# EAGLE design USBdimmer-control (EAGLE 6.5.0)
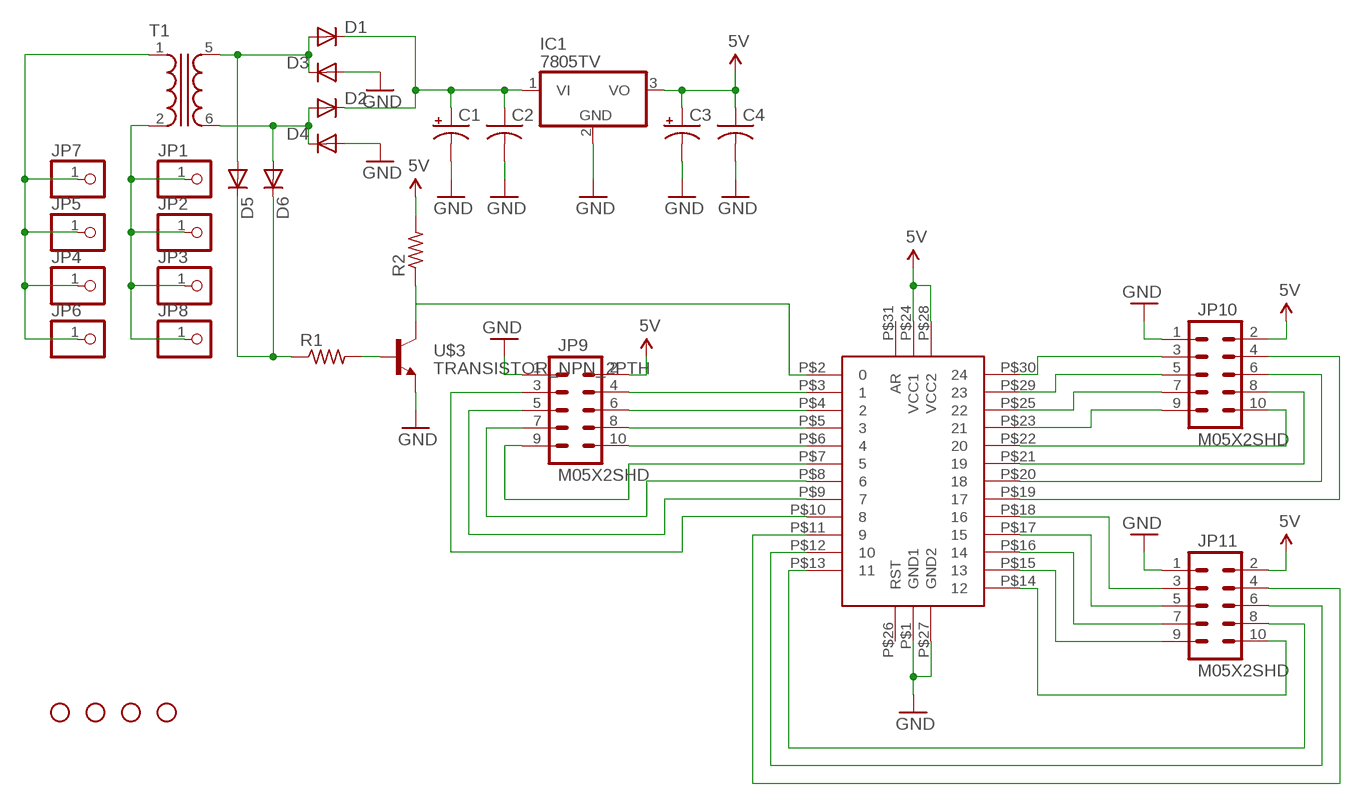
[diagram p0: schematic, sheet 1]

## Parts
C1  CPOL-USE3.5-10  [E3,5-10]
C2  C-US025-030X050  [C025-030X050]
C3  CPOL-USE3.5-10  [E3,5-10]
C4  C-US025-030X050  [C025-030X050]
D1  DIODEPTH  [DIODE-1N4001]
D2  DIODEPTH  [DIODE-1N4001]
D3  DIODEPTH  [DIODE-1N4001]
D4  DIODEPTH  [DIODE-1N4001]
D5  DIODE1N4148  [DIODE-1N4148]
D6  DIODE1N4148  [DIODE-1N4148]
IC1  7805TV  [TO220V]
JP1  PINHD-1X1  [1X01]
JP2  PINHD-1X1  [1X01]
JP3  PINHD-1X1  [1X01]
JP4  PINHD-1X1  [1X01]
JP5  PINHD-1X1  [1X01]
JP6  PINHD-1X1  [1X01]
JP7  PINHD-1X1  [1X01]
JP8  PINHD-1X1  [1X01]
JP9  M05X2SHD  [2X5-SHROUDED]
JP10  M05X2SHD  [2X5-SHROUDED]
JP11  M05X2SHD  [2X5-SHROUDED]
R1  FLIPFLOP-RES  [0805-THM]
R2  FLIPFLOP-RES  [0805-THM]
STANDOFF1  STAND-OFF  [STAND-OFF]
STANDOFF2  STAND-OFF  [STAND-OFF]
STANDOFF3  STAND-OFF  [STAND-OFF]
STANDOFF4  STAND-OFF  [STAND-OFF]
T1  XFORMER  [T70-E]
U$1  TEENSY2  [TEENSY2]
U$3  TRANSISTOR_NPN_2PTH  [TO-92]

## Nets
5V: C3.+ C4.1 IC1.3(VO) JP9.2 JP10.2 JP11.2 R2.2 U$1.P$24(VCC1) U$1.P$28(VCC2)
GND: C1.- C2.2 C3.- C4.2 D3.A D4.A IC1.2(GND) JP9.1 JP10.1 JP11.1 U$1.P$1(GND1) U$1.P$27(GND2) U$3.3(E)
N$1: D2.A D4.C D6.A T1.6(S2)
N$2: D1.A D3.C D5.A T1.5(S1)
N$3: C1.+ C2.1 D1.C D2.C IC1.1(VI)
N$4: JP10.8 U$1.P$21
N$5: JP10.6 U$1.P$20
N$6: R1.2 U$3.2(B)
N$7: D5.C D6.C R1.1
N$8: R2.1 U$1.P$2 U$3.1(C)
N$9: JP10.4 U$1.P$19
N$10: JP11.3 U$1.P$18
N$11: JP4.1 JP5.1 JP6.1 JP7.1 T1.1
N$12: JP9.4 U$1.P$3
N$13: JP9.6 U$1.P$4
N$14: JP9.8 U$1.P$5
N$15: JP9.10 U$1.P$6
N$16: JP9.9 U$1.P$7
N$17: JP9.7 U$1.P$8
N$18: JP1.1 JP2.1 JP3.1 JP8.1 T1.2
N$19: JP11.5 U$1.P$17
N$20: JP11.7 U$1.P$16
N$21: JP9.5 U$1.P$9
N$22: JP9.3 U$1.P$10
N$23: JP10.3 U$1.P$30
N$24: JP11.9 U$1.P$15
N$25: JP11.10 U$1.P$14
N$26: JP10.5 U$1.P$29
N$27: JP10.7 U$1.P$25
N$28: JP10.9 U$1.P$23
N$29: JP10.10 U$1.P$22
N$30: JP11.8 U$1.P$13
N$31: JP11.6 U$1.P$12
N$32: JP11.4 U$1.P$11
Unconnected: T1.3(P1) T1.4(P2) T1.7(S1) T1.8(S2) U$1.P$26(RST) U$1.P$31(AR)

## Library data of the parts
C1 C3 = adafruit:CPOL-US: POLARIZED CAPACITOR, American symbol
C2 C4 = adafruit:C-US: CAPACITOR, American symbol
D1-D6 = SparkFun-DiscreteSemi:DIODE: Diode These are standard reverse protection diodes and small signal diodes. SMA package can handle up to about 1A. SOD-323 can handle about 200mA. What the SOD-323 package when ordering, there are some mfgs out there that are 5-pin packages.
IC1 = linear:78*: Positive VOLTAGE REGULATOR Source: http://cache.national.com/ds/LM/LM78L05.pdf http://www.fairchildsemi.com/ds/LM/LM7805.pdf
JP1-JP8 = adafruit:PINHD-1X1: Pin header 1x1 for 0.1" spacing With round pins
JP9-JP11 = SparkFun-Connectors:M05X2: Header 5x2 Standard 10-pin dual row 0.1" header. Commonly used with AVR-ISP. Use with Spark Fun Electronics SKU: PRT-00778
R1 R2 = adafruit:FLIPFLOP-RES: Flip Flop resistor An 0805 resistor inside a standard 1/4W 5% resistor. Makes for easy mods
STANDOFF1-STANDOFF4 = SparkFun-Electromechanical:STAND-OFF: #4 Stand Off This is the mechanical footprint for a #4 phillips button head screw. Use the keepout ring to avoid running the screw head into surrounding components. SKU : PRT-00447
T1 = special:XFORMER: TRANSFORMER 2 x primary, 2 x secondary
U$1 = bodger:TEENSY2
U$3 = SparkFun-DiscreteSemi:TRANSISTOR_NPN_2: Alternate TO-92 NPN BJT

## Board
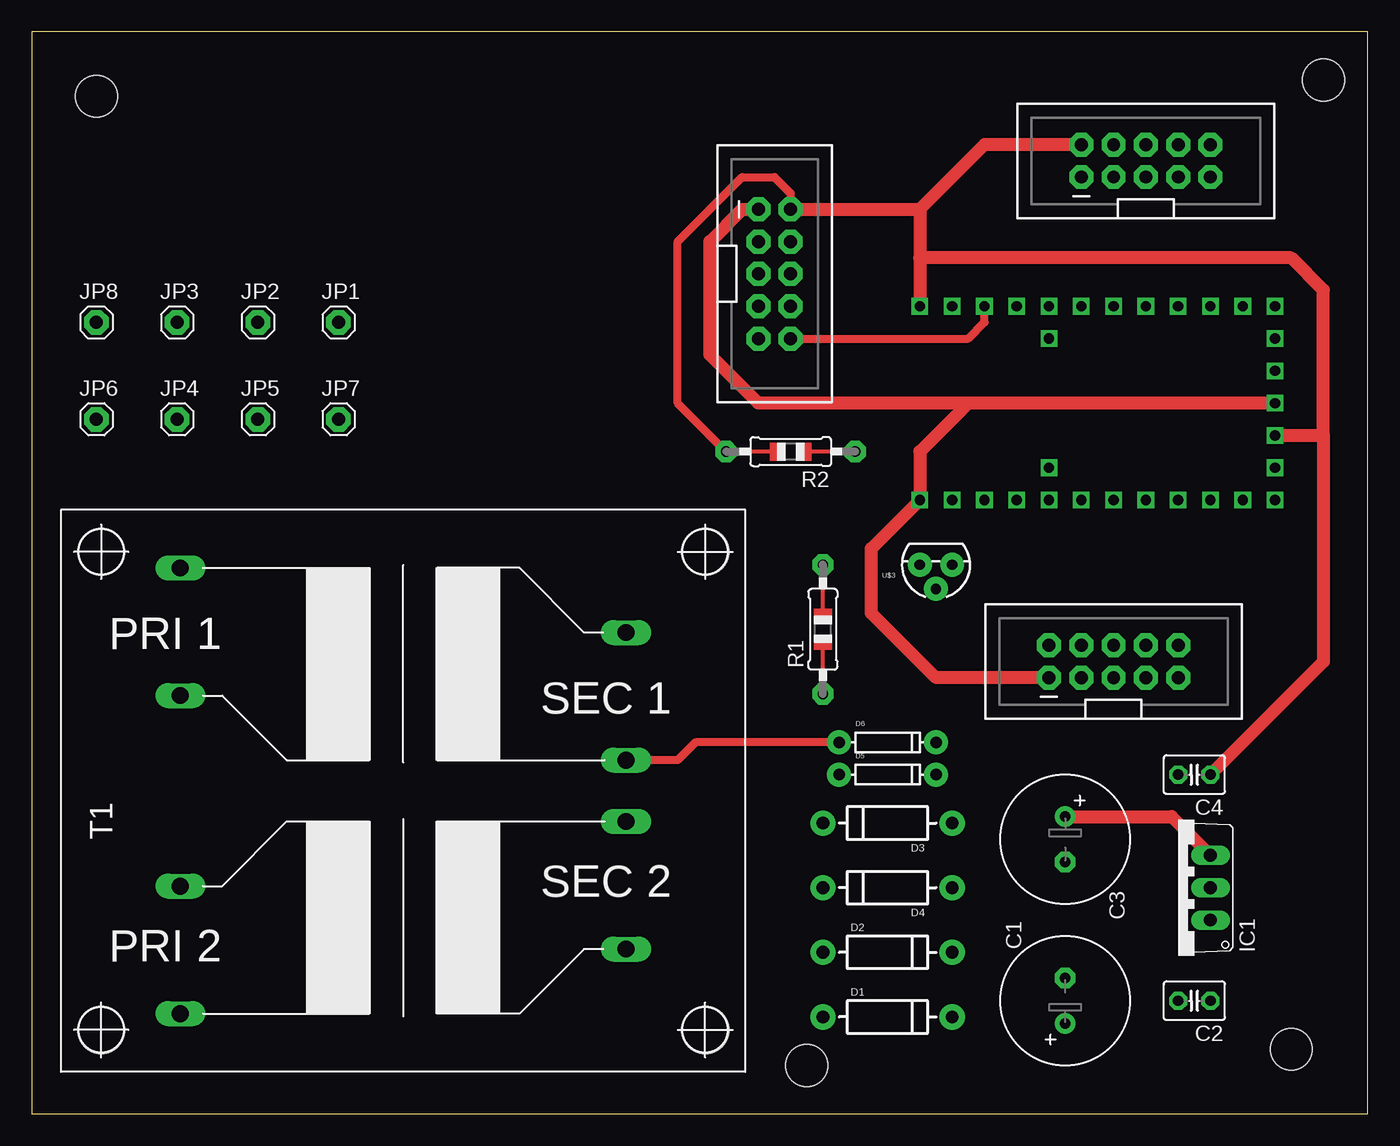
[diagram p1: board, top side]
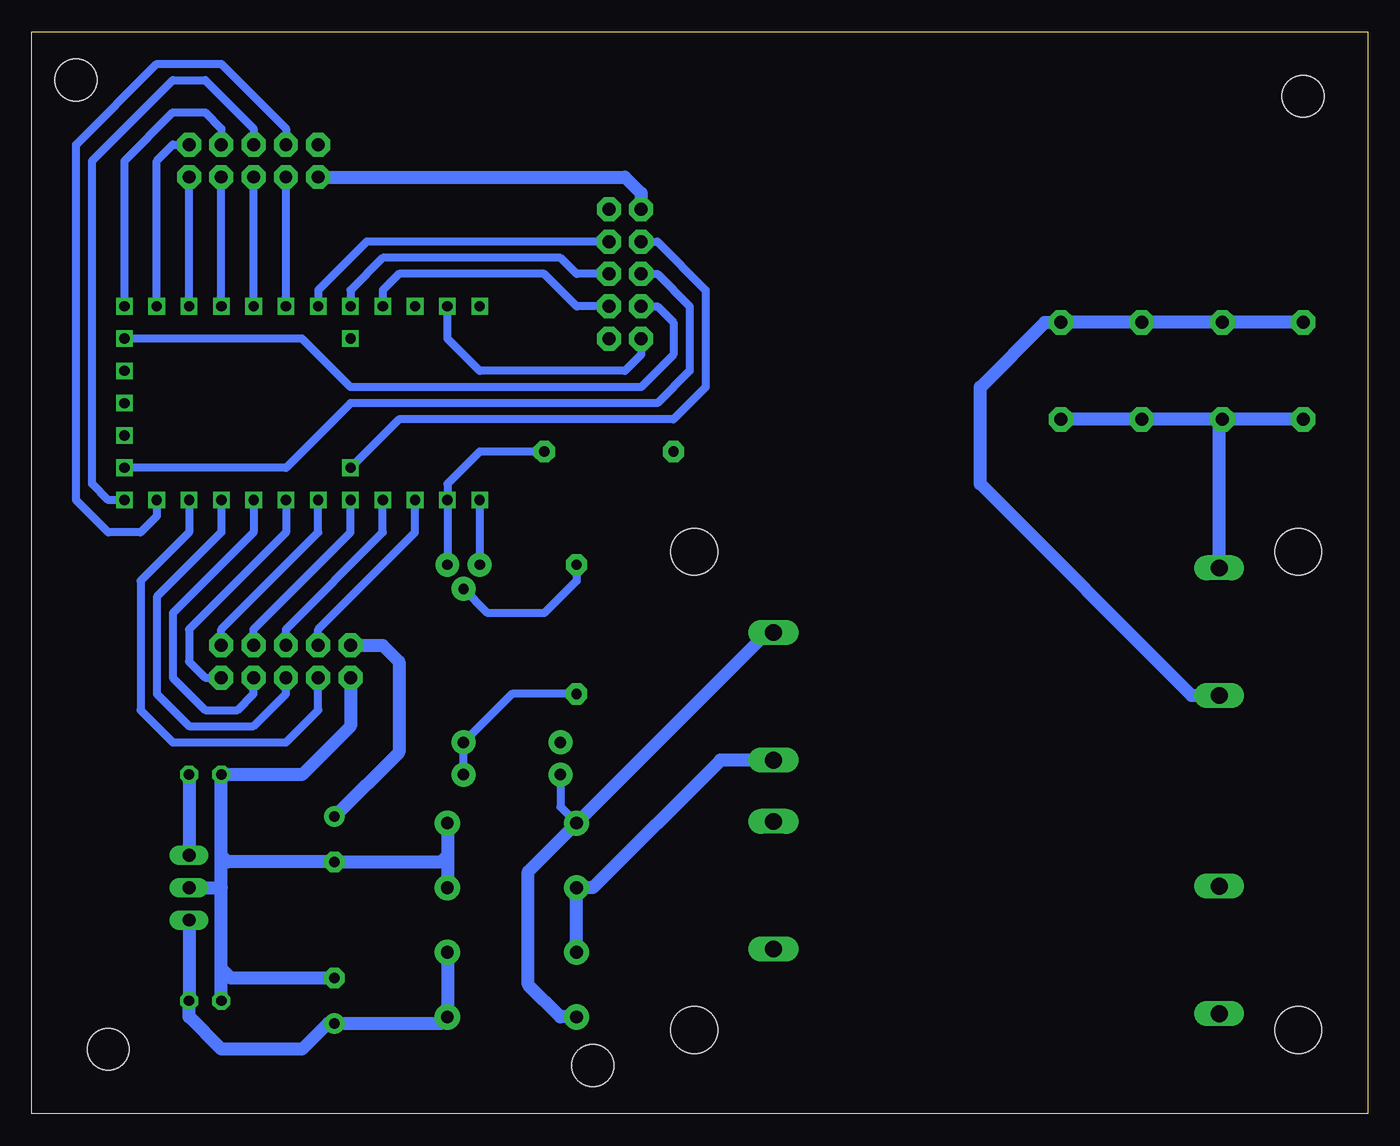
[diagram p2: board, bottom side, seen from below]

Size 105.08 x 85.08 mm. Coordinates in mm from the lower left corner, seen from the top.
Outline: 0,0 105.08,0 105.08,85.08 0,85.08 0,0
Copper layers (1*16): Top 0.035mm / dielectric 1.5mm / Bottom 0.035mm
Design rules "default": minimum track width 10mil, minimum drill 24mil, track to track 8mil, track to pad 8mil, pad to pad 8mil, via to via 8mil, smd to smd 8mil, copper to edge 40mil, drill to drill 8mil, minimum pad ring 10mil, minimum via ring 8mil, stop-mask expansion 4mil, vias tented up to drill 0mil, thermal gap 10mil

### Footprints (pad centres in the part's own frame; a part is rotated, then mirrored left to right if it is on the bottom)
E3,5-10 = drill 0.813 pad 1.6: + -1.778,0 | drill 0.813 pad 1.6 octagon: - 1.778,0
C025-030X050 = drill 0.813 pad 1.422 octagon: 1 -1.27,0; 2 1.27,0
DIODE-1N4001 = drill 1 pad 1.981: A -5.08,0; C 5.08,0
DIODE-1N4148 = drill 0.9 pad 1.88: A -3.81,0; C 3.81,0
TO220V = drill 1.016 long: 1 -2.54,-2.54; 2 0,-2.54; 3 2.54,-2.54
1X01 = drill 1.016 pad 1.93 octagon: 1 0,0
2X5-SHROUDED = drill 1.016 pad 1.88 octagon: 1 -1.27,5.08; 2 1.27,5.08; 3 -1.27,2.54; 4 1.27,2.54; 5 -1.27,0; 6 1.27,0; 7 -1.27,-2.54; 8 1.27,-2.54; 9 -1.27,-5.08; 10 1.27,-5.08
0805-THM = drill 0.813 pad 1.676 octagon: 1 -5.08,0; 2 5.08,0
STAND-OFF = hole 3.302: 0,0
T70-E = drill 1.321 long: 1 -17.526,17.526; 2 -17.526,7.493; 3 -17.526,-7.493; 4 -17.526,-17.526; 5 17.526,12.446; 6 17.526,2.413; 7 17.526,-2.413; 8 17.526,-12.446 | hole 3.708: 23.749,18.796; 23.749,-18.796; -23.749,-18.796; -23.749,18.796
TEENSY2 = drill 0.8 square: P$1 -7.62,15.24; P$2 -7.62,12.7; P$3 -7.62,10.16; P$4 -7.62,7.62; P$5 -7.62,5.08; P$6 -7.62,2.54; P$7 -7.62,0; P$8 -7.62,-2.54; P$9 -7.62,-5.08; P$10 -7.62,-7.62; P$11 -7.62,-10.16; P$12 -7.62,-12.7; P$13 7.62,-12.7; P$14 7.62,-10.16; P$15 7.62,-7.62; P$16 7.62,-5.08; P$17 7.62,-2.54; P$18 7.62,0; P$19 7.62,2.54; P$20 7.62,5.08; P$21 7.62,7.62; P$22 7.62,10.16; P$23 7.62,12.7; P$24 7.62,15.24; P$25 5.08,-12.7; P$26 2.54,-12.7; P$27 0,-12.7; P$28 -2.54,-12.7; P$29 -5.08,-12.7; P$30 -5.08,5.08; P$31 5.08,5.08
TO-92 = drill 0.813 pad 1.88: 1 -1.27,0; 2 0,1.905; 3 1.27,0

### Placement (x,y rotation side)
C1  81.28,8.89 90 top
C2  91.44,8.89 180 top
C3  81.28,21.59 270 top
C4  91.44,26.67 180 top
D1  67.31,7.62 0 top
D2  67.31,12.7 0 top
D3  67.31,22.86 180 top
D4  67.31,17.78 180 top
D5  67.31,26.67 0 top
D6  67.31,29.21 0 top
IC1  90.17,17.78 90 top
JP1  24.13,62.23 0 top
JP2  17.78,62.23 0 top
JP3  11.43,62.23 0 top
JP4  11.43,54.61 0 top
JP5  17.78,54.61 0 top
JP6  5.08,54.61 0 top
JP7  24.13,54.61 0 top
JP8  5.08,62.23 0 top
JP9  85.09,35.56 90 top
JP10  58.42,66.04 0 top
JP11  87.63,74.93 90 top
R1  62.23,38.1 90 top
R2  59.69,52.07 180 top
STANDOFF1  5.08,80.01 0 top
STANDOFF2  60.96,3.81 0 top
STANDOFF3  101.6,81.28 0 top
STANDOFF4  99.06,5.08 0 top
T1  29.21,25.4 0 top
U$1  85.09,55.88 90 top
U$3  71.12,43.18 180 top

### Tracks (layer width: path | path; a pad name or v marks a point on that pad's centre or on a via)
5V
  Top 0.61: R2.2 50.8,55.88 50.8,68.58 55.88,73.66 58.42,73.66 59.69,72.39 JP10.2
  Top 1.016: C3.+ 89.66,23.37 IC1.3 | JP11.2 74.93,76.2 69.85,71.12 | 69.85,71.12 69.85,67.31 | 69.85,67.31 U$1.P$24 | JP10.2 69.85,71.12 | 101.6,53.34 101.6,64.77 99.06,67.31 69.85,67.31 | U$1.P$28 101.6,53.34 | 101.6,53.34 101.6,35.56 C4.1
  Bottom 1.016: C4.1 IC1.3 | JP9.2 77.47,36.83 76.2,35.56 76.2,28.45 C3.+
GND
  Top 1.016: U$1.P$27 73.66,55.88 | 73.66,55.88 69.85,52.07 U$1.P$1 66.04,44.45 66.04,39.37 71.12,34.29 JP9.1 | 73.66,55.88 57.15,55.88 53.34,59.69 53.34,68.58 55.88,71.12 JP10.1
  Bottom 0.61: U$1.P$1 U$3.3
  Bottom 1.016: D3.A 72.39,20.32 | 72.39,20.32 D4.A | C2.2 90.17,11.43 | 90.17,11.43 90.17,17.78 | 90.17,17.78 90.17,20.32 | 90.17,20.32 C4.2 83.82,26.67 80.01,30.48 JP9.1 | IC1.2 90.17,17.78 | 90.17,20.32 89.66,19.81 C3.- 72.9,19.81 72.39,20.32 | C1.- 89.41,10.67 90.17,11.43 | JP11.1 58.42,73.66 57.15,72.39 JP10.1
N$1
  Top 0.61: D6.A 52.2,29.21 50.8,27.81 T1.6
  Bottom 1.016: D2.A D4.C 60.96,17.78 50.93,27.81 T1.6
N$2
  Bottom 0.61: D5.A 63.5,24.13 D3.C
  Bottom 1.016: D1.A 63.5,7.62 66.04,10.16 66.04,19.05 D3.C 47.24,37.85 T1.5
N$3
  Bottom 1.016: D2.C D1.C 72.9,7.11 C1.+ 81.79,7.11 83.82,5.08 90.17,5.08 92.71,7.62 C2.1 IC1.1
N$4
  Bottom 0.61: JP10.8 62.23,63.5 64.77,66.04 76.2,66.04 77.47,64.77 U$1.P$21
N$5
  Bottom 0.61: JP10.6 62.23,66.04 63.5,67.31 77.47,67.31 80.01,64.77 U$1.P$20
N$6
  Bottom 0.61: R1.2 62.23,41.91 64.77,39.37 69.22,39.37 U$3.2
N$7
  Bottom 0.61: D5.C D6.C 67.31,33.02 R1.1
N$8
  Bottom 0.61: R2.1 69.85,52.07 72.39,49.53 U$1.P$2 U$3.1
N$9
  Bottom 0.61: JP10.4 78.74,68.58 82.55,64.77 U$1.P$19
N$10
  Bottom 0.61: U$1.P$18 JP11.3
N$11
  Bottom 1.016: JP6.1 JP4.1 | JP4.1 JP5.1 JP7.1 | T1.1 11.68,54.36 JP4.1
N$12
  Bottom 0.61: JP9.4 82.55,38.1 74.93,45.72 U$1.P$3
N$13
  Bottom 0.61: JP9.6 85.09,38.1 77.47,45.72 U$1.P$4
N$14
  Bottom 0.61: JP9.8 87.63,38.1 80.01,45.72 U$1.P$5
N$15
  Bottom 0.61: JP9.10 90.17,38.1 82.55,45.72 U$1.P$6
N$16
  Bottom 0.61: U$1.P$7 85.09,45.72 92.71,38.1 92.71,35.56 91.44,34.29 JP9.9
N$17
  Bottom 0.61: U$1.P$8 87.63,45.72 93.98,39.37 93.98,34.29 91.44,31.75 88.9,31.75 87.63,33.02 JP9.7
N$18
  Bottom 1.016: JP8.1 JP3.1 JP2.1 JP1.1 25.4,62.23 30.48,57.15 30.48,49.53 13.84,32.89 T1.2
N$19
  Bottom 0.61: U$1.P$17 JP11.5
N$20
  Bottom 0.61: U$1.P$16 JP11.7
N$21
  Bottom 0.61: U$1.P$9 90.17,45.72 95.25,40.64 95.25,33.02 92.71,30.48 87.63,30.48 85.09,33.02 JP9.5
N$22
  Bottom 0.61: U$1.P$10 92.71,45.72 96.52,41.91 96.52,31.75 93.98,29.21 85.09,29.21 82.55,31.75 JP9.3
N$23
  Bottom 0.61: U$1.P$30 76.2,54.61 54.61,54.61 52.07,57.15 52.07,64.77 55.88,68.58 JP10.3
N$24
  Bottom 0.61: U$1.P$15 JP11.9
N$25
  Bottom 0.61: U$1.P$14 95.25,74.93 93.98,76.2 JP11.10
N$26
  Bottom 0.61: JP10.5 55.88,66.04 53.34,63.5 53.34,58.42 55.88,55.88 80.01,55.88 85.09,50.8 U$1.P$29
N$27
  Bottom 0.61: JP10.7 55.88,63.5 54.61,62.23 54.61,59.69 57.15,57.15 80.01,57.15 83.82,60.96 U$1.P$25
N$28
  Bottom 0.61: JP10.9 57.15,59.69 58.42,58.42 69.85,58.42 72.39,60.96 U$1.P$23
N$29
  Top 0.61: JP10.10 73.66,60.96 74.93,62.23 U$1.P$22
N$30
  Bottom 0.61: U$1.P$13 97.79,74.93 93.98,78.74 91.44,78.74 90.17,77.47 JP11.8
N$31
  Bottom 0.61: U$1.P$12 99.06,48.26 100.33,49.53 100.33,74.93 93.98,81.28 91.44,81.28 87.63,77.47 JP11.6
N$32
  Bottom 0.61: U$1.P$11 95.25,46.99 96.52,45.72 99.06,45.72 101.6,48.26 101.6,76.2 95.25,82.55 90.17,82.55 85.09,77.47 JP11.4